# EAGLE schematic LCD16x02_ENCODER_CIRCUIT (EAGLE 9.6.2)
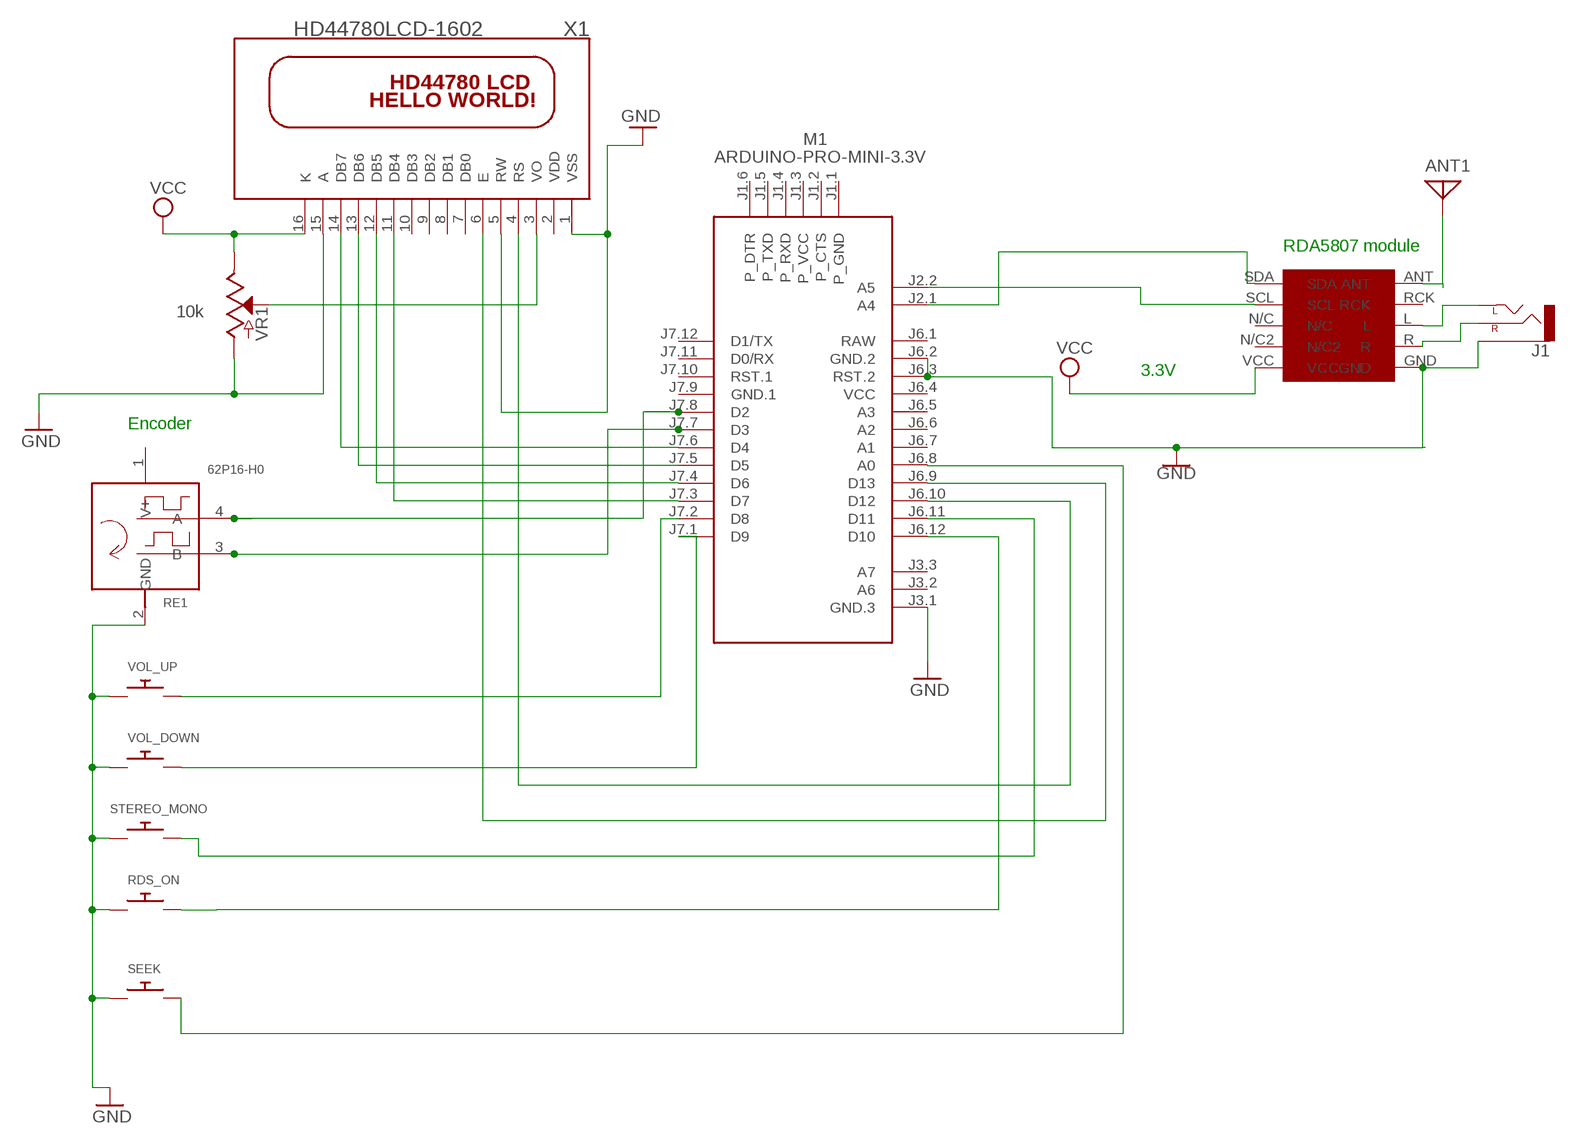
[diagram p0: schematic, sheet 1]

## Parts
ANT1  ANTENNA  [PAD-01]
J1  AUDIO_JACK_2.5MMSPECIAL_POGO_PINS  [STEREOJACK2.5MM_SPECIAL_POGOPINS]
M1  ARDUINO-PRO-MINI-3.3V  [ARDUINO-PRO-MINI]
RDS_ON  SWITCH_PUSHBUTTONC&K_KSS  [BTN_CK_KSS]
RE1  62P16-H0  [62P]
SEEK  SWITCH_PUSHBUTTONC&K_KSS  [BTN_CK_KSS]
STEREO_MONO  SWITCH_PUSHBUTTONC&K_KSS  [BTN_CK_KSS]
U$1  RDA  [RDA]
VOL_DOWN  SWITCH_PUSHBUTTONC&K_KSS  [BTN_CK_KSS]
VOL_UP  SWITCH_PUSHBUTTONC&K_KSS  [BTN_CK_KSS]
VR1  10k  POTENTIOMETER-PTH-9MM-1/20W-20%  [POT-PTH-ALPS]
X1  HD44780LCD-1602  [LCD1602]

## Nets
GND: J1.RING1(SLEEVE) M1.J3.1(GND.3) M1.J6.2(GND.2) M1.J6.3(RST.2) RDS_ON.P$1 RE1.2(GND) SEEK.P$1 STEREO_MONO.P$1 U$1.GND VOL_DOWN.P$1 VOL_UP.P$1 VR1.P$3(A) X1.15(A)
N$1: M1.J2.2(A5) U$1.SCL
N$2: M1.J2.1(A4) U$1.SDA
N$3: J1.SHIELD(LEFT) U$1.L
N$4: J1.TIP(RIGHT) U$1.R
N$5: ANT1.1 U$1.ANT
N$6: M1.J7.7(D3) RE1.3(B)
N$7: M1.J7.6(D4) X1.14(DB7)
N$8: M1.J7.5(D5) X1.13(DB6)
N$9: M1.J7.4(D6) X1.12(DB5)
N$10: M1.J6.11(D11) STEREO_MONO.P$2
N$11: M1.J6.12(D10) RDS_ON.P$2
N$12: M1.J7.3(D7) X1.11(DB4)
N$13: M1.J6.10(D12) X1.4(RS)
N$14: VR1.P$2(S) X1.3(VO)
N$15: M1.J6.9(D13) X1.6(E)
N$16: M1.J7.8(D2) RE1.4(A)
N$17: M1.J7.2(D8) VOL_UP.P$2
N$18: M1.J7.1(D9) VOL_DOWN.P$2
N$21: M1.J6.8(A0) SEEK.P$2
VCC: U$1.VCC VR1.P$1(E) X1.16(K)
VSS: X1.1(VSS) X1.5(RW) ; supply symbol labelled GND
Unconnected: M1.J1.1(P_GND) M1.J1.2(P_CTS) M1.J1.3(P_VCC) M1.J1.4(P_RXD) M1.J1.5(P_TXD) M1.J1.6(P_DTR) M1.J3.2(A6) M1.J3.3(A7) M1.J6.5(A3) M1.J6.6(A2) M1.J6.7(A1) M1.J7.10(RST.1) M1.J7.11(D0/RX) M1.J7.12(D1/TX) RE1.1(V+) U$1.N/C U$1.N/C2 U$1.RCK X1.2(VDD) X1.7(DB0) X1.8(DB1) X1.9(DB2) X1.10(DB3)

## Notes on the sheet
- RDA5807 module
- 3.3V
- Encoder

## Power pins joined to a net without a drawn wire
GND.1: M1.J7.9(GND.1)
RAW: M1.J6.1(RAW)
VCC: M1.J6.4(VCC)

## Library data of the parts
ANT1 = discrete:ANTENNA: Antenna
J1 = SparkFun-Connectors:AUDIO_JACK_2.5MM: Audio Jack 2.5mm variants of PTH and SMT audio jacks. SparkFun Products: SparkFun PicoBoard <https://www.sparkfun.com/products/11888>- 2.5mm SMD
M1 = diy-modules:ARDUINO-PRO-MINI-*: Arduino Pro Mini and compatible devices More details available here: https://www.arduino.cc/en/Main/ArduinoBoardProMini Click here to find device on ebay.com <http://www.ebay.com/sch/arduino+pro+mini>
RDS_ON SEEK STEREO_MONO VOL_DOWN VOL_UP = adafruit:SWITCH_PUSHBUTTON: Buttons SOFTTOUCHSMD_SJ - Soft touch temporary push button (Super Junk Akihabara) Compatible with SKPMANE010 [Mouser: 688-SKPMAN] C&K_KSS = Digikey: KSS221GLFS
RE1 = rotary-encoder:62P*0
U$1 = RDA:RDA
VR1 = SparkFun-Resistors:POTENTIOMETER: Potentiometer (Pot) Three-terminal potentiometers, with an adjustable wiper and two adjustable resistors. A pot can be used to create a configurable voltage divider, or as a variable resistor. Variants ALPS_POT and ALPS_POT_KIT - PTH, breadboard compatible, 9mm square pots Rotary Potentiometer - Linear (10k ohm) <https://www.sparkfun.com/products/9288> (COM-09288) The KIT variant exposes copper on only one side of the PTH pad, so the part can only be assembled on one side of the PCB. Useful for beginner soldering kits.; PROD_ID: RES-09177; SF_SKU: COM-09288
X1 = adafruit:HD44780LCD: HD44780 LCD Standard character type LCDs, available in sizes from 8x1 to 40x4!